# Altium schematic sheet RFID.SchDoc
size A
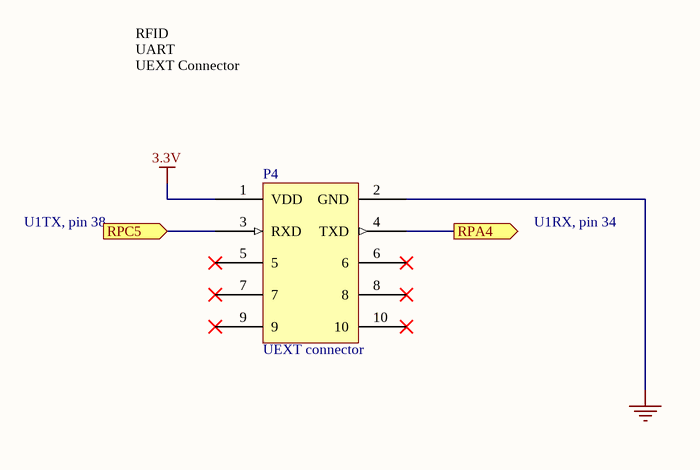
[diagram p0: RFID.SchDoc]

## Parts
P4  UEXT connector  [Conneteur UEXT]

## Ports
RPA4 (out), RPC5 (in)

## Nets
3.3V: P4.1(VDD)
GND: P4.2(GND)
RPA4: P4.4(TXD) ; port RPA4
RPC5: P4.3(RXD) ; port RPC5

Not connected (* = marked no-connect by the designer): P4 5* 6* 7* 8* 9* 10*

## Notes on the sheet
- RFID
  UART
  UEXT Connector
- U1TX, pin 38
- U1RX, pin 34

## Library data of the parts
P4 = UEXT connector: FABRIQUANT: OLIMEX; REF FABRIQUANT: MOD-RFID1356MIFARE; FOURNISSEUR: OLIMEX; REF FOURNISSEUR: MOD-RFID1356MIFARE